# Altium schematic sheet Goal_Sensing.SchDoc
size Letter; SheetNumber: 6; SheetTotal: 14
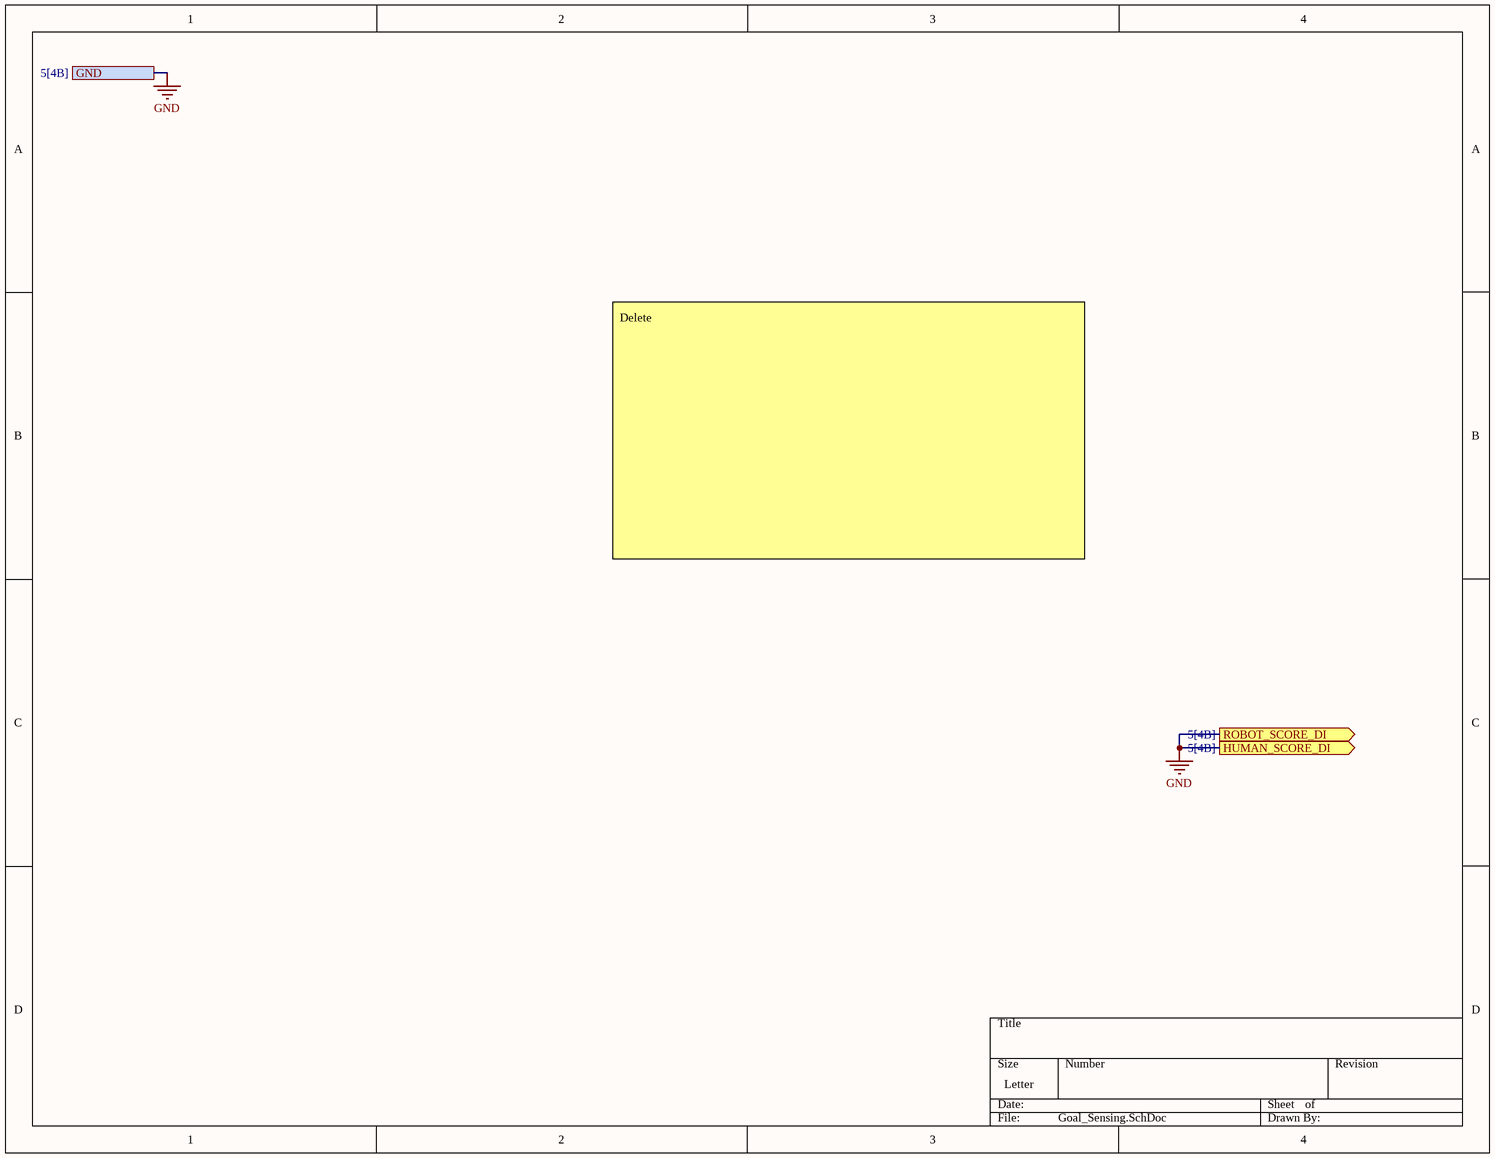
[diagram p0: Goal_Sensing.SchDoc]

## Ports
GND (see 5[4B]), HUMAN_SCORE_DI (out, see 5[4B]), ROBOT_SCORE_DI (out, see 5[4B])

## Nets
GND: port ROBOT_SCORE_DI, port HUMAN_SCORE_DI, port GND

## Notes on the sheet
- Delete